# EAGLE schematic tpic-words (EAGLE 6.3)
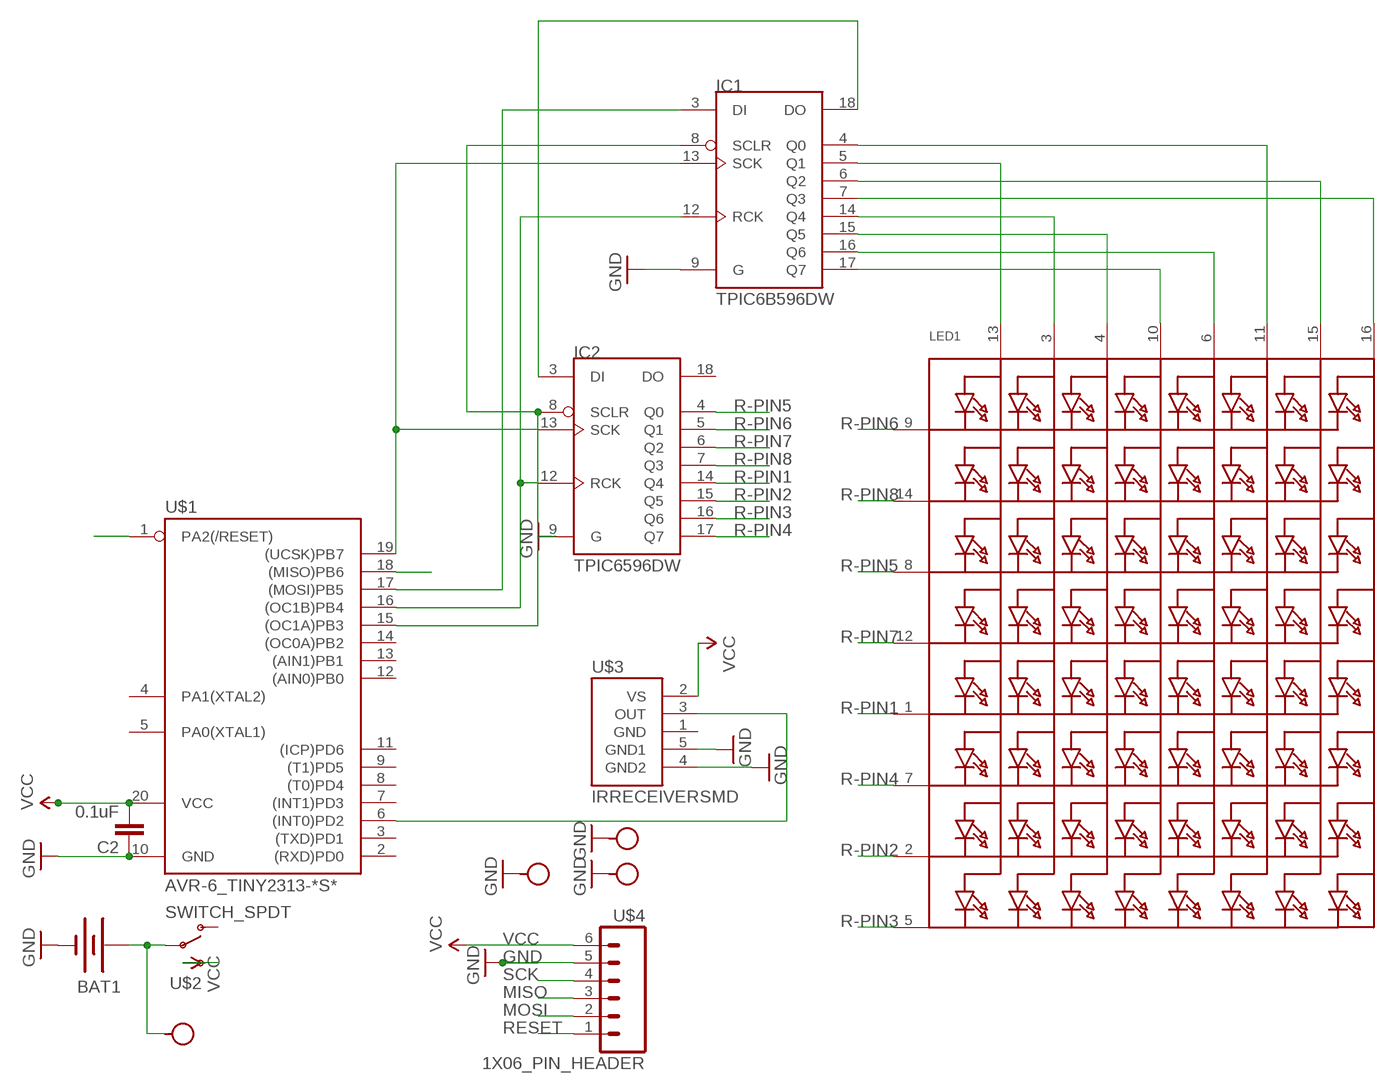
[diagram p0: schematic, sheet 1]

## Parts
BAT1  NSL_SPARKFUN_BATTERY  [NSL_BATTICON_20MM_CLIPPED]
C2  0.1uF  .1UF-CER  [0402-CAP]
H1  SEW_HOLE-SMALL  [SIMPLE_HOLE_SM]
H2  SEW_HOLE-SMALL  [SIMPLE_HOLE_SM]
H3  SEW_HOLE-SMALL  [SIMPLE_HOLE_SM]
H4  SEW_HOLE-SMALL  [SIMPLE_HOLE_SM]
IC1  TPIC6B596DW  [SO20W]
IC2  TPIC6596DW  [SO20W]
LED1  SEGMENT_8X8_ROWCATHODESEG-HEADERS  [SEGMENT-HEADERS]
U$1  AVR-6_TINY2313-*S*  [AVR-6_SO20L$]
U$2  SWITCH_SPDT  [KPS-1290]
U$3  IRRECEIVERSMD  [TSOP8523]
U$4  1X06_PIN_HEADER  [1X06_EDGE]

## Nets
GND: BAT1.2(-) C2.1 H1.P$1 H3.P$1 H4.P$1 IC1.9(G) IC2.9(G) U$1.10(GND) U$3.4(GND2) U$3.5(GND1) U$4.5
MISO: U$1.18((MISO)PB6) U$4.3
MOSI: IC1.3(DI) U$1.17((MOSI)PB5) U$4.2
N$2: BAT1.1(+) H2.P$1 U$2.P
N$10: IC1.7(Q3) LED1.16(A8)
N$11: IC1.6(Q2) LED1.15(A7)
N$12: IC1.5(Q1) LED1.13(A1)
N$13: IC1.4(Q0) LED1.11(A6)
N$14: IC1.17(Q7) LED1.10(A4)
N$15: IC1.16(Q6) LED1.6(A5)
N$16: IC1.15(Q5) LED1.4(A3)
N$17: IC1.14(Q4) LED1.3(A2)
N$18: IC1.18(DO) IC2.3(DI)
N$21: U$1.6((INT0)PD2) U$3.3(OUT)
N$22: IC1.12(RCK) IC2.12(RCK) U$1.16((OC1B)PB4)
N$23: IC1.8(SCLR) IC2.8(SCLR) U$1.15((OC1A)PB3)
R-PIN1: IC2.14(Q4) LED1.1(K5)
R-PIN2: IC2.15(Q5) LED1.2(K7)
R-PIN3: IC2.16(Q6) LED1.5(K8)
R-PIN4: IC2.17(Q7) LED1.7(K6)
R-PIN5: IC2.4(Q0) LED1.8(K3)
R-PIN6: IC2.5(Q1) LED1.9(K1)
R-PIN7: IC2.6(Q2) LED1.12(K4)
R-PIN8: IC2.7(Q3) LED1.14(K2)
RESET: U$1.1(PA2(/RESET)) U$4.1
SCK: IC1.13(SCK) IC2.13(SCK) U$1.19((UCSK)PB7) U$4.4
VCC: C2.2 U$1.20(VCC) U$2.S U$3.2(VS) U$4.6
Unconnected: IC2.18(DO) U$1.2((RXD)PD0) U$1.3((TXD)PD1) U$1.4(PA1(XTAL2)) U$1.5(PA0(XTAL1)) U$1.7((INT1)PD3) U$1.8((T0)PD4) U$1.9((T1)PD5) U$1.11((ICP)PD6) U$1.12((AIN0)PB0) U$1.13((AIN1)PB1) U$1.14((OC0A)PB2) U$2.O U$3.1(GND)

## Power pins joined to a net without a drawn wire
GND: IC1.10(GND) IC1.11(GND) IC1.19(GND) IC2.19(GND)
PGND: IC2.1(PGND) IC2.10(PGND) IC2.11(PGND) IC2.20(PGND)
VCC: IC1.2(VCC) IC2.2(VCC)

## Library data of the parts
BAT1 = NSL:NSL_SPARKFUN_BATTERY: Battery Holders Various common sizes : AA, AAA, 20mm coin cell and 12mm coin cell.
C2 = SparkFun-Capacitors:.1UF-CER: .1uF ceramic SMT CAP-00810- 25V +80%/-20% (0603) CAP-08390- 100V 10% (0603) CAP-08604- 25V 5% (0603); PROD_ID: CAP-00810
H1-H4 = LilyPad-Wearables:SEW_HOLE-SMALL: .070" hole with 20mil annular ring
IC1 = tpic:TPIC6B596
IC2 = tpic:TPIC6596
LED1 = mattsEagleParts:SEGMENT_8X8_ROWCATHODE: 8x8 LED Segment Displays: Row = Cathode 0.7" Red 8X8 Matrix, 1.9mm Round LEDs - BL-M07C881UR 1.2" Red 8x8 Matrix, 3.0mm Round LEDs - BL-M12A881UR 1.2" Red 8x8 Matrix, 3.0mm Square LEDs - BL-M12A883
U$1 = NSL:AVR-6_TINY2313*: Atmel Tiny2313 2K Flash, 128 bytes EEPROM, 128 bytes RAM
U$2 = SparkFun-Electromechanical:SWITCH_SPDT: Side-actuated SPDT slide switch, as used on the Arduino Pro
U$3 = SparkFun-Sensors:IRRECEIVER: TSOP85238 38kHz IR receiver with built in demodulation and filtering- SEN-08545
U$4 = NSL:1X06_PIN_HEADER: 6 Pin Edge Connector Standard 6-pin 0.1" header.